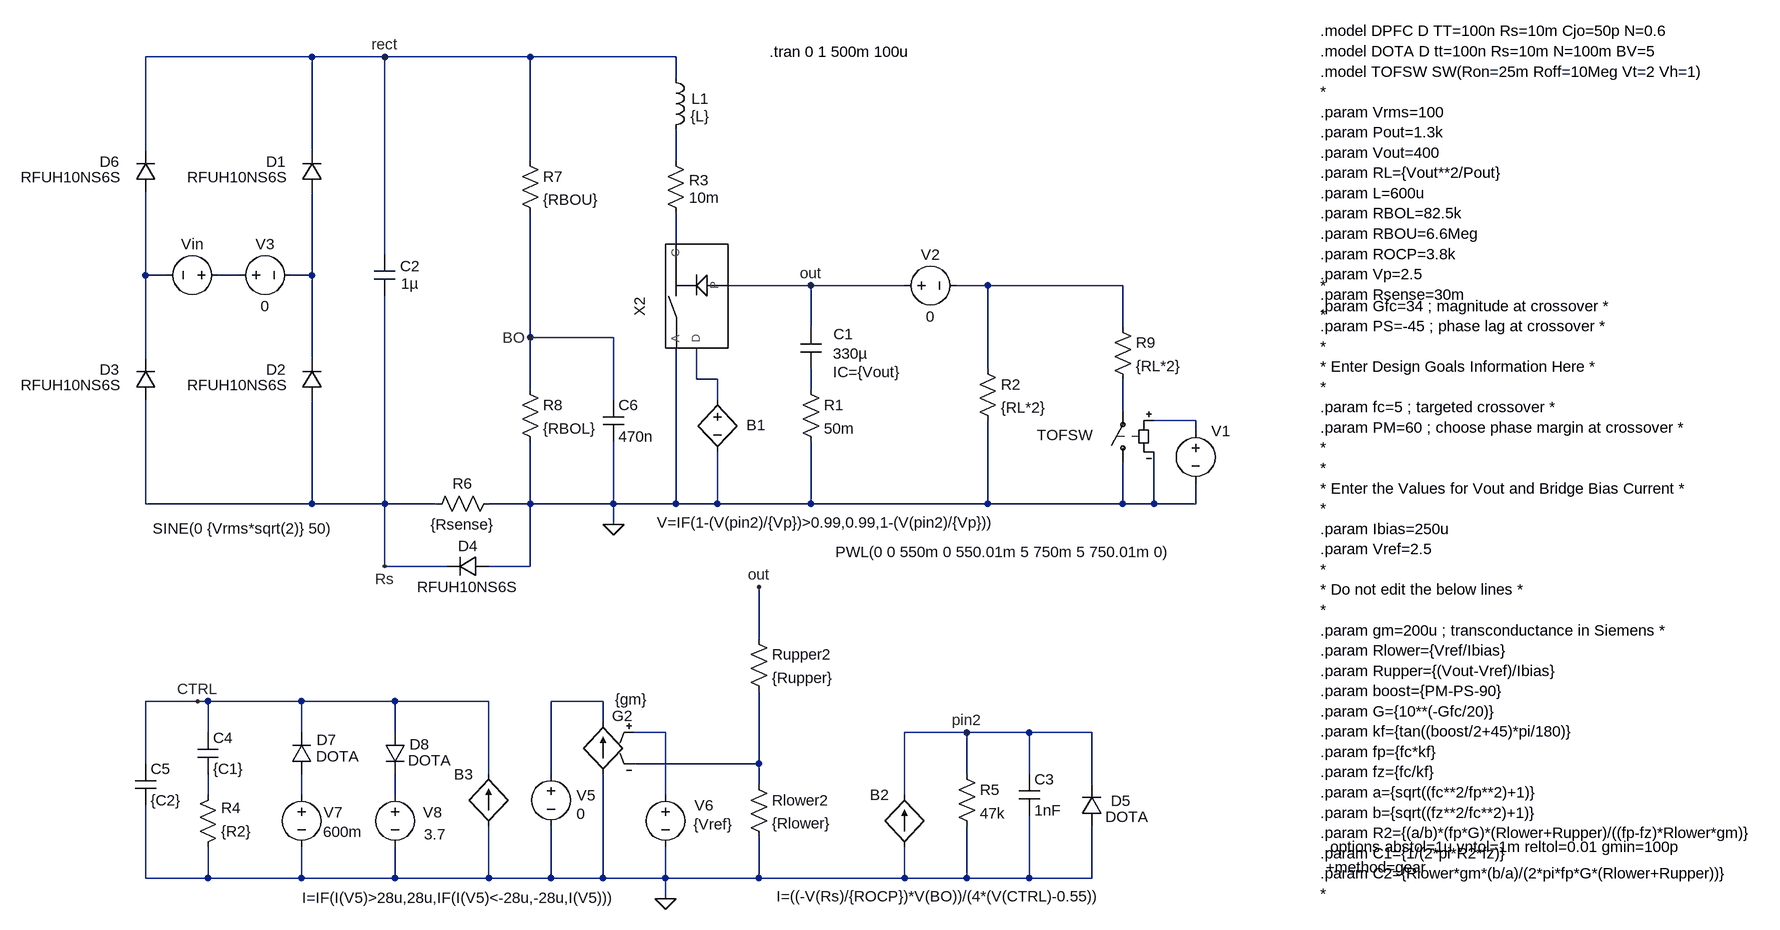
[diagram p0: schematic Boost CCM PFC - avg - load step.asc]
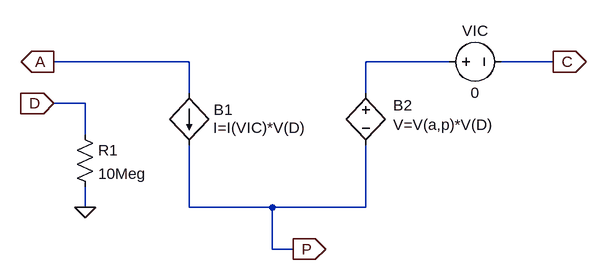
[diagram p1: sub-circuit pwmvm.asc]
Boost CCM PFC - avg - load step.asc, the LTspice schematic file:
Version 4.1
SHEET 1 2292 1256
WIRE -576 -224 -832 -224
WIRE -464 -224 -576 -224
WIRE -240 -224 -464 -224
WIRE -16 -224 -240 -224
WIRE -16 -192 -16 -224
WIRE -832 -80 -832 -224
WIRE -576 -80 -576 -224
WIRE -240 -64 -240 -224
WIRE -16 -64 -16 -112
WIRE -16 64 -16 16
WIRE -464 80 -464 -224
WIRE -832 112 -832 -16
WIRE -800 112 -832 112
WIRE -688 112 -720 112
WIRE -576 112 -576 -16
WIRE -576 112 -608 112
WIRE 192 128 64 128
WIRE 336 128 192 128
WIRE 464 128 416 128
WIRE 672 128 464 128
WIRE 192 192 192 128
WIRE 672 192 672 128
WIRE -240 208 -240 16
WIRE -112 208 -240 208
WIRE -832 240 -832 112
WIRE -576 240 -576 112
WIRE 464 256 464 128
WIRE 16 272 16 224
WIRE 48 272 16 272
WIRE -240 288 -240 208
WIRE 192 288 192 256
WIRE -112 304 -112 208
WIRE 48 304 48 272
WIRE 672 320 672 272
WIRE 784 336 720 336
WIRE 784 352 784 336
WIRE -832 464 -832 304
WIRE -576 464 -576 304
WIRE -576 464 -832 464
WIRE -464 464 -464 144
WIRE -464 464 -576 464
WIRE -384 464 -464 464
WIRE -240 464 -240 368
WIRE -240 464 -304 464
WIRE -112 464 -112 368
WIRE -112 464 -240 464
WIRE -16 464 -16 224
WIRE -16 464 -112 464
WIRE 48 464 48 384
WIRE 48 464 -16 464
WIRE 192 464 192 368
WIRE 192 464 48 464
WIRE 464 464 464 336
WIRE 464 464 192 464
WIRE 672 464 672 400
WIRE 672 464 464 464
WIRE 720 464 720 384
WIRE 720 464 672 464
WIRE 784 464 784 432
WIRE 784 464 720 464
WIRE -112 496 -112 464
WIRE -464 560 -464 464
WIRE -368 560 -464 560
WIRE -240 560 -240 464
WIRE -240 560 -304 560
WIRE 112 672 112 592
WIRE -752 768 -832 768
WIRE -736 768 -752 768
WIRE -592 768 -736 768
WIRE -448 768 -592 768
WIRE -304 768 -448 768
WIRE -128 768 -208 768
WIRE -128 800 -128 768
WIRE -736 816 -736 768
WIRE -592 816 -592 768
WIRE -448 816 -448 768
WIRE -32 816 -80 816
WIRE 432 816 336 816
WIRE 528 816 432 816
WIRE 624 816 528 816
WIRE -832 864 -832 768
WIRE 112 864 112 752
WIRE 112 864 -80 864
WIRE -304 880 -304 768
WIRE -208 880 -208 768
WIRE 432 880 432 816
WIRE 528 880 528 816
WIRE 112 896 112 864
WIRE 624 896 624 816
WIRE -736 912 -736 880
WIRE -592 912 -592 880
WIRE -448 912 -448 880
WIRE -32 912 -32 816
WIRE 336 912 336 816
WIRE -832 1040 -832 928
WIRE -736 1040 -736 992
WIRE -736 1040 -832 1040
WIRE -592 1040 -592 992
WIRE -592 1040 -736 1040
WIRE -448 1040 -448 992
WIRE -448 1040 -592 1040
WIRE -304 1040 -304 960
WIRE -304 1040 -448 1040
WIRE -208 1040 -208 960
WIRE -208 1040 -304 1040
WIRE -128 1040 -128 880
WIRE -128 1040 -208 1040
WIRE -32 1040 -32 992
WIRE -32 1040 -128 1040
WIRE 112 1040 112 976
WIRE 112 1040 -32 1040
WIRE 336 1040 336 992
WIRE 336 1040 112 1040
WIRE 432 1040 432 960
WIRE 432 1040 336 1040
WIRE 528 1040 528 944
WIRE 528 1040 432 1040
WIRE 624 1040 624 960
WIRE 624 1040 528 1040
WIRE -32 1072 -32 1040
FLAG 192 128 out
FLAG -464 -224 rect
FLAG -32 1072 0
FLAG -752 768 CTRL
FLAG 112 592 out
FLAG 432 816 pin2
FLAG -240 208 BO
FLAG -112 496 0
FLAG -464 560 Rs
DATAFLAG 288 128 ""
DATAFLAG 48 864 ""
SYMBOL cap 176 192 R0
WINDOW 0 51 11 Left 2
WINDOW 3 50 41 Left 2
WINDOW 123 50 69 Left 2
SYMATTR InstName C1
SYMATTR Value 330µ
SYMATTR Value2 IC={Vout}
SYMBOL res 176 272 R0
SYMATTR InstName R1
SYMATTR Value 50m
SYMBOL res 448 240 R0
SYMATTR InstName R2
SYMATTR Value {RL*2}
SYMBOL res -32 -80 R0
WINDOW 0 36 46 Left 2
WINDOW 3 36 73 Left 2
SYMATTR InstName R3
SYMATTR Value 10m
SYMBOL ind -32 -208 R0
WINDOW 0 40 48 Left 2
WINDOW 3 39 75 Left 2
SYMATTR InstName L1
SYMATTR Value {L}
SYMBOL cap -480 80 R0
WINDOW 0 40 18 Left 2
WINDOW 3 41 45 Left 2
SYMATTR InstName C2
SYMATTR Value 1µ
SYMBOL voltage -704 112 R90
WINDOW 0 -32 56 VBottom 2
WINDOW 3 374 -22 VTop 2
WINDOW 123 0 0 Left 0
WINDOW 39 0 0 Left 0
SYMATTR InstName Vin
SYMATTR Value SINE(0 {Vrms*sqrt(2)} 50)
SYMBOL voltage -704 112 R270
WINDOW 0 32 56 VTop 2
WINDOW 3 -32 56 VBottom 2
WINDOW 123 0 0 Left 0
WINDOW 39 0 0 Left 0
SYMATTR InstName V3
SYMATTR Value 0
SYMBOL bv 48 288 R0
WINDOW 0 45 55 Left 2
WINDOW 3 -93 205 Left 2
SYMATTR InstName B1
SYMATTR Value V=IF(1-(V(pin2)/{Vp})>0.99,0.99,1-(V(pin2)/{Vp}))
SYMBOL res 96 880 R0
SYMATTR InstName Rlower2
SYMATTR Value {Rlower}
SYMBOL res 96 656 R0
SYMATTR InstName Rupper2
SYMATTR Value {Rupper}
SYMBOL voltage -32 896 R0
WINDOW 0 45 32 Left 2
WINDOW 3 43 61 Left 2
WINDOW 123 0 0 Left 0
WINDOW 39 0 0 Left 0
SYMATTR InstName V6
SYMATTR Value {Vref}
SYMBOL g -128 784 M0
WINDOW 0 -46 6 Left 2
WINDOW 3 -69 -19 Left 2
SYMATTR InstName G2
SYMATTR Value {gm}
SYMBOL diode -576 880 R180
WINDOW 0 -38 53 Left 2
WINDOW 3 -73 27 Left 2
SYMATTR InstName D7
SYMATTR Value DOTA
SYMBOL diode -464 816 R0
WINDOW 0 38 18 Left 2
WINDOW 3 36 43 Left 2
SYMATTR InstName D8
SYMATTR Value DOTA
SYMBOL voltage -592 896 R0
WINDOW 0 34 43 Left 2
WINDOW 3 33 73 Left 2
WINDOW 123 0 0 Left 0
WINDOW 39 0 0 Left 0
SYMATTR InstName V7
SYMATTR Value 600m
SYMBOL voltage -448 896 R0
WINDOW 0 43 43 Left 2
WINDOW 3 45 77 Left 2
WINDOW 123 0 0 Left 0
WINDOW 39 0 0 Left 0
SYMATTR InstName V8
SYMATTR Value 3.7
SYMBOL voltage -208 864 R0
WINDOW 0 39 49 Left 2
WINDOW 3 39 77 Left 2
SYMATTR InstName V5
SYMATTR Value 0
SYMBOL bi -304 960 R180
WINDOW 0 24 80 Left 2
WINDOW 3 -202 -110 Left 2
SYMATTR InstName B3
SYMATTR Value I=IF(I(V5)>28u,28u,IF(I(V5)<-28u,-28u,I(V5)))
SYMBOL cap -752 880 M180
WINDOW 0 24 56 Left 2
WINDOW 3 24 8 Left 2
SYMATTR InstName C4
SYMATTR Value {C1}
SYMBOL res -752 1008 M180
WINDOW 0 36 76 Left 2
WINDOW 3 36 40 Left 2
SYMATTR InstName R4
SYMATTR Value {R2}
SYMBOL cap -848 928 M180
WINDOW 0 24 56 Left 2
WINDOW 3 24 8 Left 2
SYMATTR InstName C5
SYMATTR Value {C2}
SYMBOL PWMVM 0 160 R270
SYMATTR InstName X2
SYMBOL bi 336 992 R180
WINDOW 0 24 80 Left 2
WINDOW 3 -308 -76 Left 2
SYMATTR InstName B2
SYMATTR Value I=((-V(Rs)/{ROCP})*V(BO))/(4*(V(CTRL)-0.55))
SYMBOL res 416 864 R0
SYMATTR InstName R5
SYMATTR Value 47k
SYMBOL cap 512 880 R0
SYMATTR InstName C3
SYMATTR Value 1nF
SYMBOL res -288 448 R90
WINDOW 0 0 56 VBottom 2
WINDOW 3 32 56 VTop 2
SYMATTR InstName R6
SYMATTR Value {Rsense}
SYMBOL res -256 -80 R0
SYMATTR InstName R7
SYMATTR Value {RBOU}
SYMBOL res -256 272 R0
SYMATTR InstName R8
SYMATTR Value {RBOL}
SYMBOL cap -128 304 R0
SYMATTR InstName C6
SYMATTR Value 470n
SYMBOL diode -816 -16 R180
WINDOW 0 56 47 Left 2
WINDOW 3 52 23 Left 2
SYMATTR InstName D6
SYMATTR Value RFUH10NS6S
SYMBOL diode -560 -16 R180
WINDOW 0 56 47 Left 2
WINDOW 3 52 23 Left 2
SYMATTR InstName D1
SYMATTR Value RFUH10NS6S
SYMBOL diode -560 304 R180
WINDOW 0 56 47 Left 2
WINDOW 3 52 23 Left 2
SYMATTR InstName D2
SYMATTR Value RFUH10NS6S
SYMBOL diode -816 304 R180
WINDOW 0 56 47 Left 2
WINDOW 3 52 23 Left 2
SYMATTR InstName D3
SYMATTR Value RFUH10NS6S
SYMBOL diode -304 544 R90
WINDOW 0 0 32 VBottom 2
WINDOW 3 32 32 VTop 2
SYMATTR InstName D4
SYMATTR Value RFUH10NS6S
SYMBOL sw 672 416 R180
WINDOW 3 47 44 Invisible 2
WINDOW 0 45 58 Left 2
SYMATTR Value TOFSW
SYMATTR InstName TOFSW
SYMBOL res 656 176 R0
SYMATTR InstName R9
SYMATTR Value {RL*2}
SYMBOL voltage 784 336 R0
WINDOW 3 -554 202 Left 2
WINDOW 123 0 0 Left 0
WINDOW 39 0 0 Left 0
SYMATTR Value PWL(0 0 550m 0 550.01m 5 750m 5 750.01m 0)
SYMATTR InstName V1
SYMBOL diode 640 960 R180
WINDOW 0 -44 39 Left 2
WINDOW 3 -72 14 Left 2
SYMATTR InstName D5
SYMATTR Value DOTA
SYMBOL voltage 320 128 R270
WINDOW 0 32 56 VTop 2
WINDOW 3 -32 56 VBottom 2
SYMATTR InstName V2
SYMATTR Value 0
TEXT 976 -264 Left 2 !.model DPFC D TT=100n Rs=10m Cjo=50p N=0.6\n.model DOTA D tt=100n Rs=10m N=100m BV=5\n.model TOFSW SW(Ron=25m Roff=10Meg Vt=2 Vh=1)\n*\n.param Vrms=100\n.param Pout=1.3k\n.param Vout=400\n.param RL={Vout**2/Pout}\n.param L=600u\n.param RBOL=82.5k\n.param RBOU=6.6Meg\n.param ROCP=3.8k\n.param Vp=2.5\n.param Rsense=30m\n*
TEXT 128 -232 Left 2 !.tran 0 1 500m 100u
TEXT 984 992 Left 2 !.options abstol=1u vntol=1m reltol=0.01 gmin=100p\n+method=gear
TEXT 976 128 Left 2 !*\n.param Gfc=34 ; magnitude at crossover *\n.param PS=-45 ; phase lag at crossover *\n*\n* Enter Design Goals Information Here *\n*\n.param fc=5 ; targeted crossover *\n.param PM=60 ; choose phase margin at crossover *\n*\n*\n* Enter the Values for Vout and Bridge Bias Current *\n*\n.param Ibias=250u\n.param Vref=2.5\n*\n* Do not edit the below lines *\n*\n.param gm=200u ; transconductance in Siemens *\n.param Rlower={Vref/Ibias}\n.param Rupper={(Vout-Vref)/Ibias}\n.param boost={PM-PS-90}\n.param G={10**(-Gfc/20)}\n.param kf={tan((boost/2+45)*pi/180)}\n.param fp={fc*kf}\n.param fz={fc/kf}\n.param a={sqrt((fc**2/fp**2)+1)}\n.param b={sqrt((fz**2/fc**2)+1)}\n.param R2={(a/b)*(fp*G)*(Rlower+Rupper)/((fp-fz)*Rlower*gm)}\n.param C1={1/(2*pi*R2*fz)}\n.param C2={Rlower*gm*(b/a)/(2*pi*fp*G*(Rlower+Rupper))}\n*

pwmvm.asc, the sub-circuit schematic file:
Version 4
SHEET 1 880 680
WIRE 64 48 -144 48
WIRE 464 48 336 48
WIRE 624 48 544 48
WIRE 64 96 64 48
WIRE 336 96 336 48
WIRE -96 112 -144 112
WIRE -96 160 -96 112
WIRE -96 272 -96 240
WIRE 64 272 64 176
WIRE 192 272 64 272
WIRE 336 272 336 176
WIRE 336 272 192 272
WIRE 192 336 192 272
WIRE 224 336 192 336
FLAG -96 272 0
FLAG -144 48 A
IOPIN -144 48 Out
FLAG 624 48 C
IOPIN 624 48 Out
FLAG 224 336 P
IOPIN 224 336 Out
FLAG -144 112 D
IOPIN -144 112 In
SYMBOL bi 64 96 R0
WINDOW 0 38 26 Left 2
WINDOW 3 37 53 Left 2
SYMATTR InstName B1
SYMATTR Value I=I(VIC)*V(D)
SYMBOL bv 336 80 R0
WINDOW 0 42 35 Left 2
WINDOW 3 42 65 Left 2
SYMATTR InstName B2
SYMATTR Value V=V(a,p)*V(D)
SYMBOL voltage 448 48 R270
WINDOW 0 32 56 VTop 2
WINDOW 3 -32 56 VBottom 2
WINDOW 123 0 0 Left 0
WINDOW 39 0 0 Left 0
SYMATTR InstName VIC
SYMATTR Value 0
SYMBOL res -112 144 R0
SYMATTR InstName R1
SYMATTR Value 10Meg

The netlist it stands for:
* Boost CCM PFC - avg - load step.asc
C1 out N008 330µ IC={Vout}
R1 N008 0 50m
R2 N006 0 {RL*2}
R3 N001 N002 10m
L1 rect N001 {L}
C2 rect Rs 1µ
Vin N004 N003 SINE(0 {Vrms*sqrt(2)} 50)
V3 N004 N005 0
B1 N007 0 V=IF(1-(V(pin2)/{Vp})>0.99,0.99,1-(V(pin2)/{Vp}))
Rlower2 N013 0 {Rlower}
Rupper2 out N013 {Rupper}
V6 N012 0 {Vref}
G2 0 N011 N012 N013 {gm}
D7 N015 CTRL DOTA
D8 CTRL N016 DOTA
V7 N015 0 600m
V8 N016 0 3.7
V5 N011 0 0
B3 0 CTRL I=IF(I(V5)>28u,28u,IF(I(V5)<-28u,-28u,I(V5)))
C4 N014 CTRL {C1}
R4 0 N014 {R2}
C5 0 CTRL {C2}
X§X2 N007 0 N002 out pwmvm
B2 0 pin2 I=((-V(Rs)/{ROCP})*V(BO))/(4*(V(CTRL)-0.55))
R5 pin2 0 47k
C3 pin2 0 1nF
R6 0 Rs {Rsense}
R7 rect BO {RBOU}
R8 BO 0 {RBOL}
C6 BO 0 470n
D6 N003 rect RFUH10NS6S
D1 N005 rect RFUH10NS6S
D2 Rs N005 RFUH10NS6S
D3 Rs N003 RFUH10NS6S
D4 0 Rs RFUH10NS6S
S§TOFSW 0 N009 N010 0 TOFSW
R9 N006 N009 {RL*2}
V1 N010 0 PWL(0 0 550m 0 550.01m 5 750m 5 750.01m 0)
D5 0 pin2 DOTA
V2 out N006 0

* block symbol definitions
.subckt pwmvm D A C P
B1 A P I=I(VIC)*V(D)
B2 N001 P V=V(a,p)*V(D)
VIC N001 C 0
R1 D 0 10Meg
.ends pwmvm

.model D D
.lib standard.dio
.model DPFC D TT=100n Rs=10m Cjo=50p N=0.6
.model DOTA D tt=100n Rs=10m N=100m BV=5
.model TOFSW SW(Ron=25m Roff=10Meg Vt=2 Vh=1)
*
.param Vrms=100
.param Pout=1.3k
.param Vout=400
.param RL={Vout**2/Pout}
.param L=600u
.param RBOL=82.5k
.param RBOU=6.6Meg
.param ROCP=3.8k
.param Vp=2.5
.param Rsense=30m
*
.tran 0 1 500m 100u
.options abstol=1u vntol=1m reltol=0.01 gmin=100p
+method=gear
*
.param Gfc=34 ; magnitude at crossover *
.param PS=-45 ; phase lag at crossover *
*
* Enter Design Goals Information Here *
*
.param fc=5 ; targeted crossover *
.param PM=60 ; choose phase margin at crossover *
*
*
* Enter the Values for Vout and Bridge Bias Current *
*
.param Ibias=250u
.param Vref=2.5
*
* Do not edit the below lines *
*
.param gm=200u ; transconductance in Siemens *
.param Rlower={Vref/Ibias}
.param Rupper={(Vout-Vref)/Ibias}
.param boost={PM-PS-90}
.param G={10**(-Gfc/20)}
.param kf={tan((boost/2+45)*pi/180)}
.param fp={fc*kf}
.param fz={fc/kf}
.param a={sqrt((fc**2/fp**2)+1)}
.param b={sqrt((fz**2/fc**2)+1)}
.param R2={(a/b)*(fp*G)*(Rlower+Rupper)/((fp-fz)*Rlower*gm)}
.param C1={1/(2*pi*R2*fz)}
.param C2={Rlower*gm*(b/a)/(2*pi*fp*G*(Rlower+Rupper))}
*
.backanno
.end